# Altium schematic sheet Sheet_Multivibrator.SchDoc
size A4; SheetNumber: 1; SheetTotal: 1
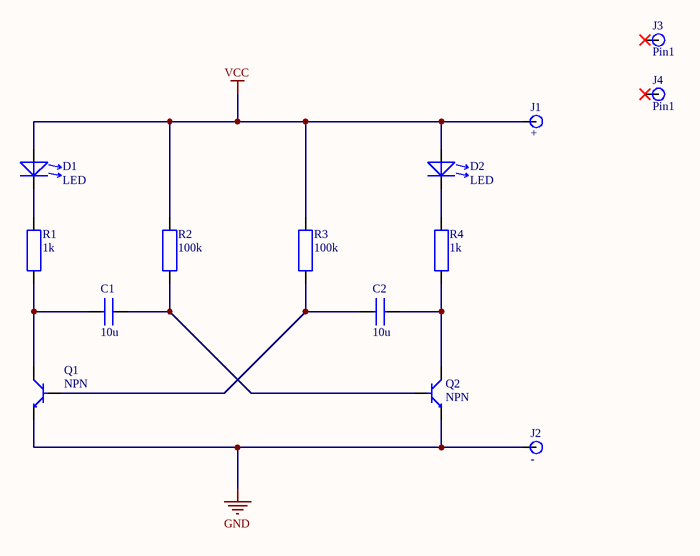
[diagram p0: Sheet_Multivibrator.SchDoc]

## Parts
C1  10u  [Capacitor smd 1206]
C2  10u  [Capacitor smd 1206]
D1  LED  [LED smd 1206]
D2  LED  [LED smd 1206]
J1  +  [Pin1]
J2  -  [Pin1]
J3  Pin1  [Pin1]
J4  Pin1  [Pin1]
Q1  NPN  [SOT23]
Q2  NPN  [SOT23]
R1  1k  [Resistor smd 1206]
R2  100k  [Resistor smd 1206]
R3  100k  [Resistor smd 1206]
R4  1k  [Resistor smd 1206]

## Nets
GND: J2.1 Q1.E Q2.E
VCC: D1.A D2.A J1.1 R2.2 R3.2
NetC1_1: C1.1 Q1.C R1.1
NetC1_2: C1.2 Q2.B R2.1
NetC2_1: C2.1 Q1.B R3.1
NetC2_2: C2.2 Q2.C R4.1
NetD1_C: D1.C R1.2
NetD2_C: D2.C R4.2

Not connected (* = marked no-connect by the designer): J3 1*; J4 1*

## Library data of the parts
C1 C2 = Capasitor
J1 J2 = Pin1
Q1 Q2 = Transistor NPN
R1-R4 = Resistor